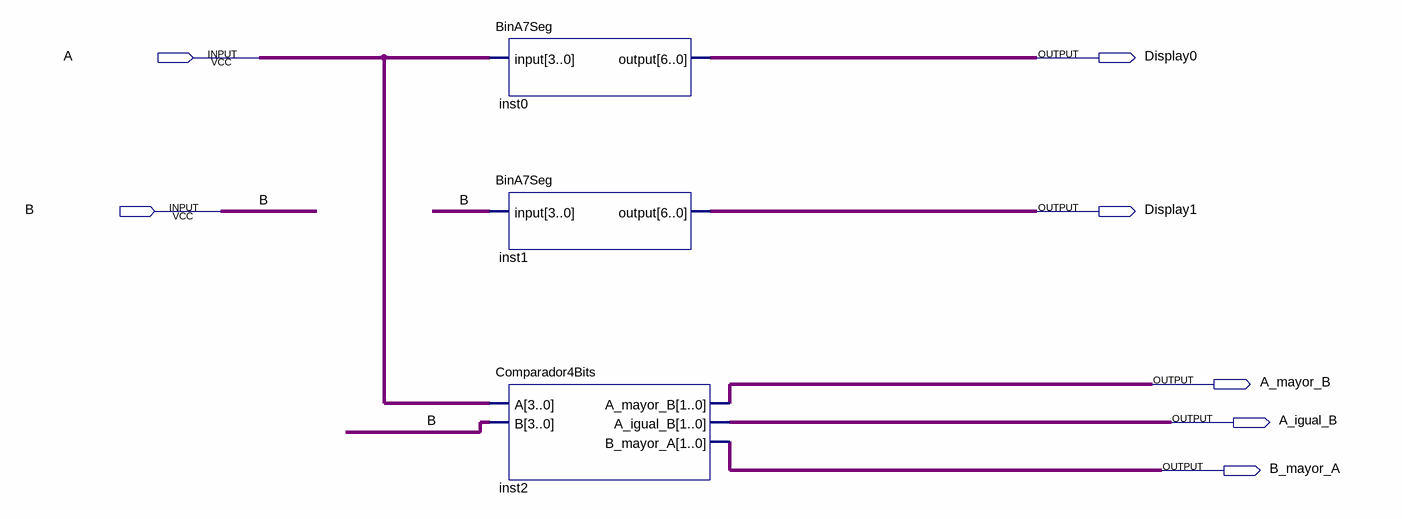
[diagram p0: schematic sheet]
// Quartus schematic Practica4.bdf as structural Verilog: 3 symbols, 7 pins
module Practica4 (
  input  A,
  input  B,
  output Display0,
  output Display1,
  output A_mayor_B,
  output A_igual_B,
  output B_mayor_A
);

  wire [1:0] inst2_a_igual_b, inst2_a_mayor_b, inst2_b_mayor_a;
  wire [3:0] undriven;
  wire [6:0] inst0_output, inst1_output;

  BinA7Seg inst0 (.\input (undriven), .\output (inst0_output));
  BinA7Seg inst1 (.\input ({4{B}}), .\output (inst1_output));
  Comparador4Bits inst2 (
    .A(undriven), .B({4{B}}), .A_mayor_B(inst2_a_mayor_b), .A_igual_B(inst2_a_igual_b),
    .B_mayor_A(inst2_b_mayor_a));
endmodule
